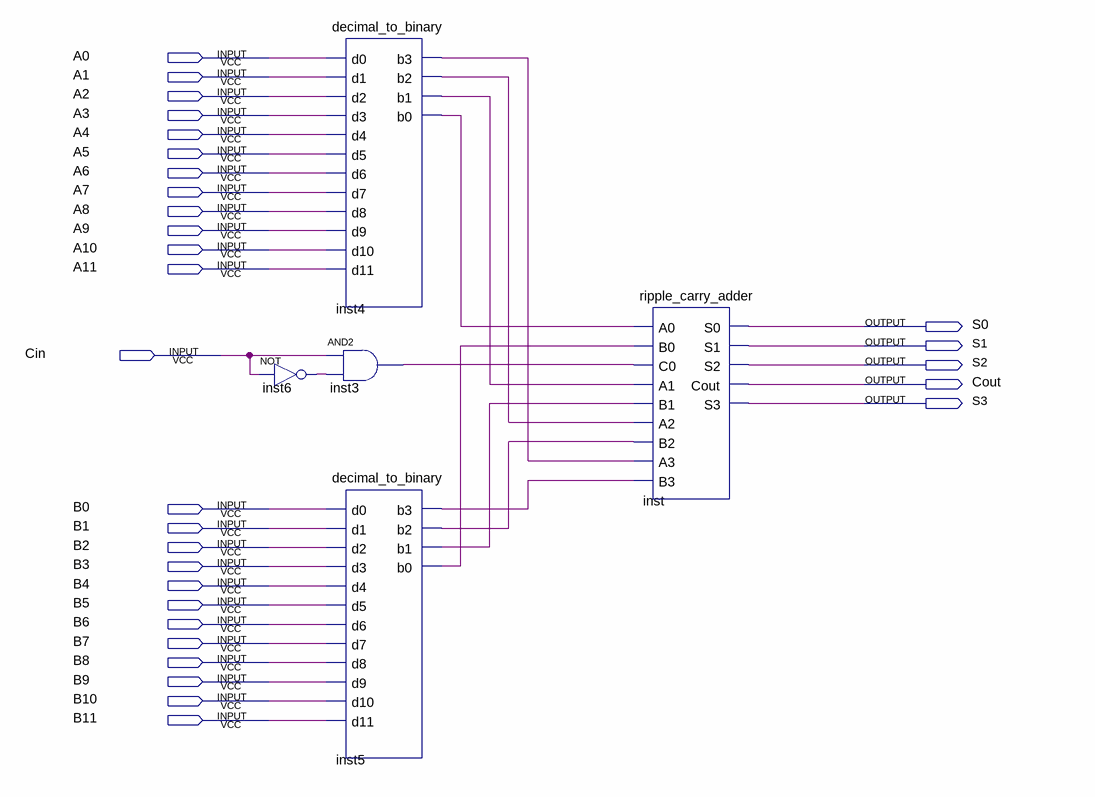
[diagram p0: schematic sheet]
// Quartus schematic week3_2.bdf as structural Verilog: 5 symbols, 30 pins
module week3_2 (
  input  A0,
  input  A1,
  input  A2,
  input  A3,
  input  A4,
  input  A5,
  input  A6,
  input  A7,
  input  A8,
  input  A9,
  input  A10,
  input  A11,
  input  Cin,
  input  B0,
  input  B1,
  input  B2,
  input  B3,
  input  B4,
  input  B5,
  input  B6,
  input  B7,
  input  B8,
  input  B9,
  input  B10,
  input  B11,
  output S0,
  output S1,
  output S2,
  output Cout,
  output S3
);

  wire inst3_out, inst4_b0, inst4_b1, inst4_b2, inst4_b3, inst5_b0, inst5_b1, inst5_b2, inst5_b3, inst6_out;

  not inst6 (inst6_out, Cin);
  decimal_to_binary inst4 (
    .d0(A0), .d1(A1), .d2(A2), .d3(A3), .d4(A4), .d5(A5), .d6(A6), .d7(A7), .d8(A8), .d9(A9), .d10(A10),
    .d11(A11), .b3(inst4_b3), .b2(inst4_b2), .b1(inst4_b1), .b0(inst4_b0));
  and inst3 (inst3_out, Cin, inst6_out);
  decimal_to_binary inst5 (
    .d0(B0), .d1(B1), .d2(B2), .d3(B3), .d4(B4), .d5(B5), .d6(B6), .d7(B7), .d8(B8), .d9(B9), .d10(B10),
    .d11(B11), .b3(inst5_b3), .b2(inst5_b2), .b1(inst5_b1), .b0(inst5_b0));
  ripple_carry_adder inst (
    .A0(inst4_b0), .B0(inst5_b0), .C0(inst3_out), .A1(inst4_b1), .B1(inst5_b1), .A2(inst4_b2), .B2(inst5_b2),
    .A3(inst4_b3), .B3(inst5_b3), .S0(S0), .S1(S1), .S2(S2), .Cout(Cout), .S3(S3));
endmodule
